# Altium schematic sheet Interface.SchDoc
size A4
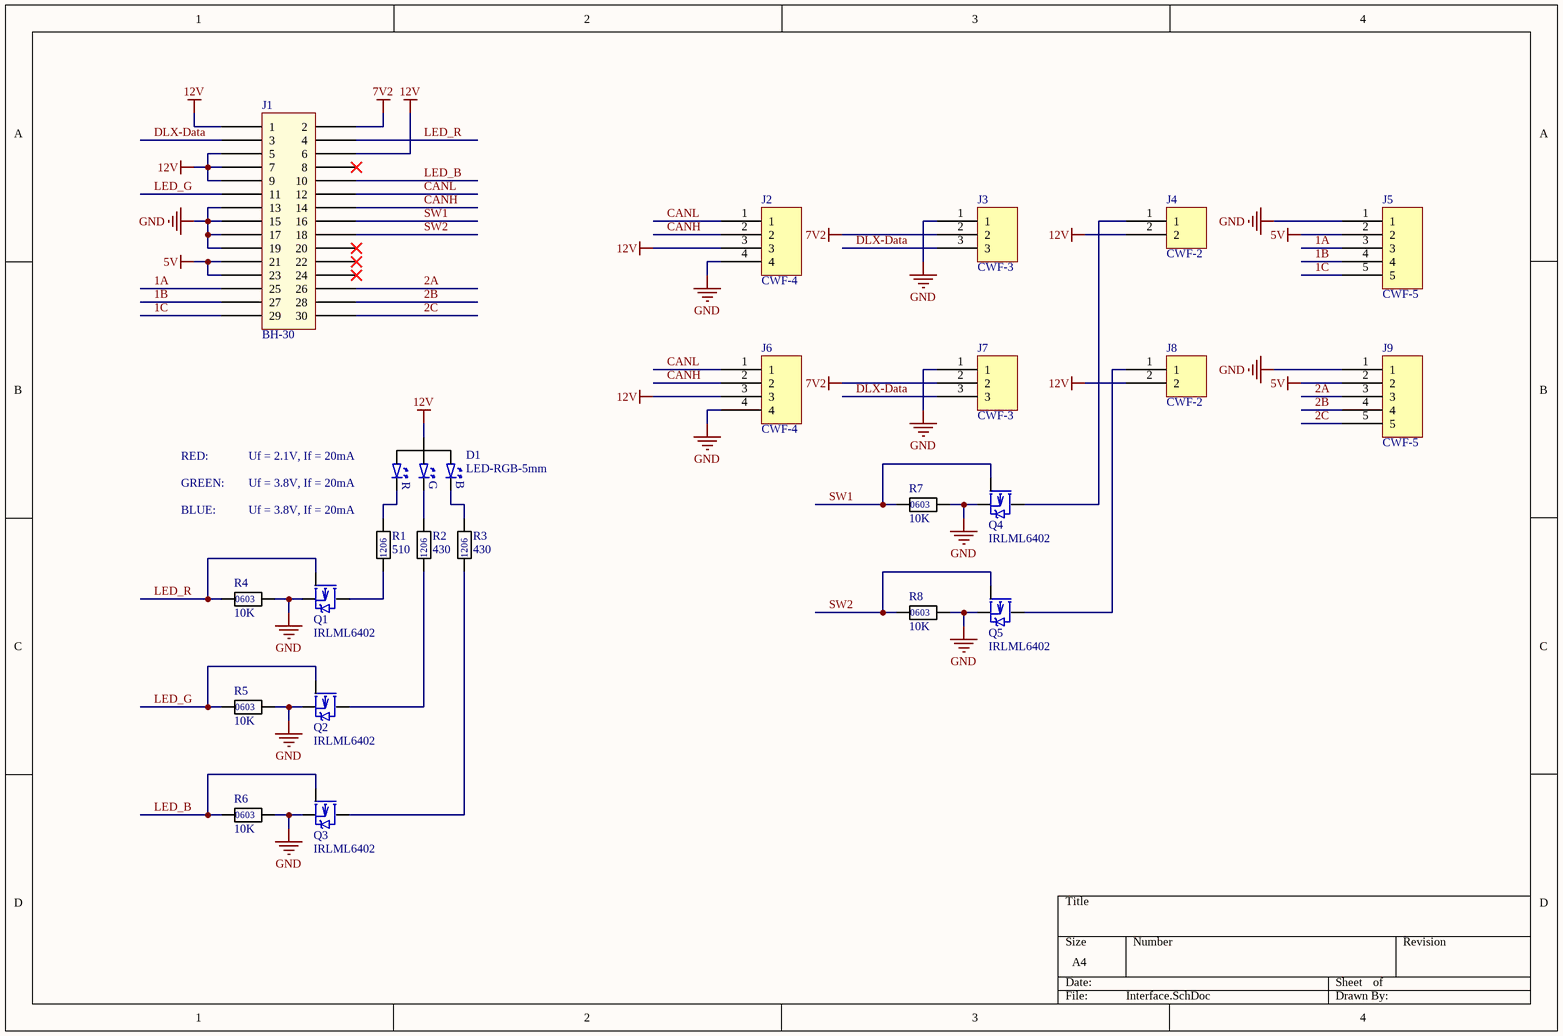
[diagram p0: Interface.SchDoc]

## Parts
D1  LED-RGB-5mm  [BL-L515]
J1  BH-30  [BH-30]
J2  CWF-4  [CWF-4]
J3  CWF-3  [DS1066-03]
J4  CWF-2  [CWF-2]
J5  CWF-5  [CWF-5]
J6  CWF-4  [CWF-4]
J7  CWF-3  [DS1066-03]
J8  CWF-2  [CWF-2]
J9  CWF-5  [CWF-5]
Q1  IRLML6402  [SOT23]
Q2  IRLML6402  [SOT23]
Q3  IRLML6402  [SOT23]
Q4  IRLML6402  [SOT23]
Q5  IRLML6402  [SOT23]
R1  510  [CHIP_R_1206]
R2  430  [CHIP_R_1206]
R3  430  [CHIP_R_1206]
R4  10K  [CHIP_R_0603]
R5  10K  [CHIP_R_0603]
R6  10K  [CHIP_R_0603]
R7  10K  [CHIP_R_0603]
R8  10K  [CHIP_R_0603]

## Nets
5V: J1.21 J1.23 J5.2 J9.2
7V2: J1.2 J3.2 J7.2
12V: D1.3(A) J1.1 J1.5 J1.6 J1.7 J1.9 J2.3 J4.2 J6.3 J8.2
GND: J1.13 J1.15 J1.17 J1.19 J2.4 J3.1 J5.1 J6.4 J7.1 J9.1 Q1.2(S) Q2.2(S) Q3.2(S) Q4.2(S) Q5.2(S) R4.2 R5.2 R6.2 R7.2 R8.2
1A: J1.25 J5.3
1B: J1.27 J5.4
1C: J1.29 J5.5
2A: J1.26 J9.3
2B: J1.28 J9.4
2C: J1.30 J9.5
CANH: J1.14 J2.2 J6.2
CANL: J1.12 J2.1 J6.1
DLX-Data: J1.3 J3.3 J7.3
LED_B: J1.10 Q3.1(G) R6.1
LED_G: J1.11 Q2.1(G) R5.1
LED_R: J1.4 Q1.1(G) R4.1
SW1: J1.16 Q4.1(G) R7.1
SW2: J1.18 Q5.1(G) R8.1
NetD1_1: D1.1(B) R3.2
NetD1_2: D1.2(G) R2.2
NetD1_4: D1.4(R) R1.2
NetJ4_1: J4.1 Q4.3(D)
NetJ8_1: J8.1 Q5.3(D)
NetQ1_3: Q1.3(D) R1.1
NetQ2_3: Q2.3(D) R2.1
NetQ3_3: Q3.3(D) R3.1

Not connected (* = marked no-connect by the designer): J1 8* 20* 22* 24*

## Notes on the sheet
- RED:
- GREEN:
- BLUE:
- (near D1) Uf = 2.1V, If = 20mA
- Uf = 3.8V, If = 20mA
- (near R1) Uf = 3.8V, If = 20mA
- (in symbol RES_0603) 0603
- (in symbol RES_1206) 1206

## Library data of the parts
J2 J6 = CWF-4: Connector
J3 J7 = CWF-3(R): Conector
J4 J8 = CWF-2: Connector
Q1-Q5 = IRLML6402: p-chanal MOSFET
R1-R3 = RES_1206: Resistor
R4-R8 = RES_0603